# Altium schematic sheet Incline harness.SchDoc
size A
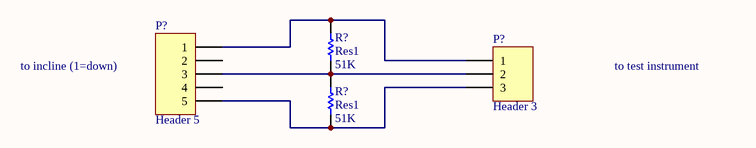
[diagram p0: Incline harness.SchDoc]

## Parts
(Parts that share a designator on the sheet are numbered #1, #2 ... from top to bottom, then left to right.)
P?#1  Header 5  [HDR1X5]
P?#2  Header 3  [HDR1X3]
R?#1  Res1  value 51K  [AXIAL-0.3]
R?#2  Res1  value 51K  [AXIAL-0.3]

## Nets
NetP?#1_1: P?#1.1 P?#2.1 R?#1.2
NetP?#1_3: P?#1.3 P?#2.2 R?#1.1 R?#2.1
NetP?#1_5: P?#1.5 P?#2.3 R?#2.2

Not connected (* = marked no-connect by the designer): P?#1 2 4

## Notes on the sheet
- to incline (1=down)
- to test instrument

## Library data of the parts
P?#1 = Header 5: Header, 5-Pin; LatestRevisionDate: 17-Jul-2002; LatestRevisionNote: Re-released for DXP Platform.; Publisher: Altium Limited
P?#2 = Header 3: Header, 3-Pin; LatestRevisionDate: 17-Jul-2002; LatestRevisionNote: Re-released for DXP Platform.; Publisher: Altium Limited
R?#1 R?#2 = Res1: Resistor; Published: 8-Jun-2000; LatestRevisionDate: 17-Jul-2002; LatestRevisionNote: Re-released for DXP Platform.; PackageReference: AXIAL-0.3; Publisher: Altium Limited; PackageDescription: Axial Device, Thru-Hole; 2 Leads; 0.3 in Pin Spacing